# Altium project Charge Amplifier.PrjPcb
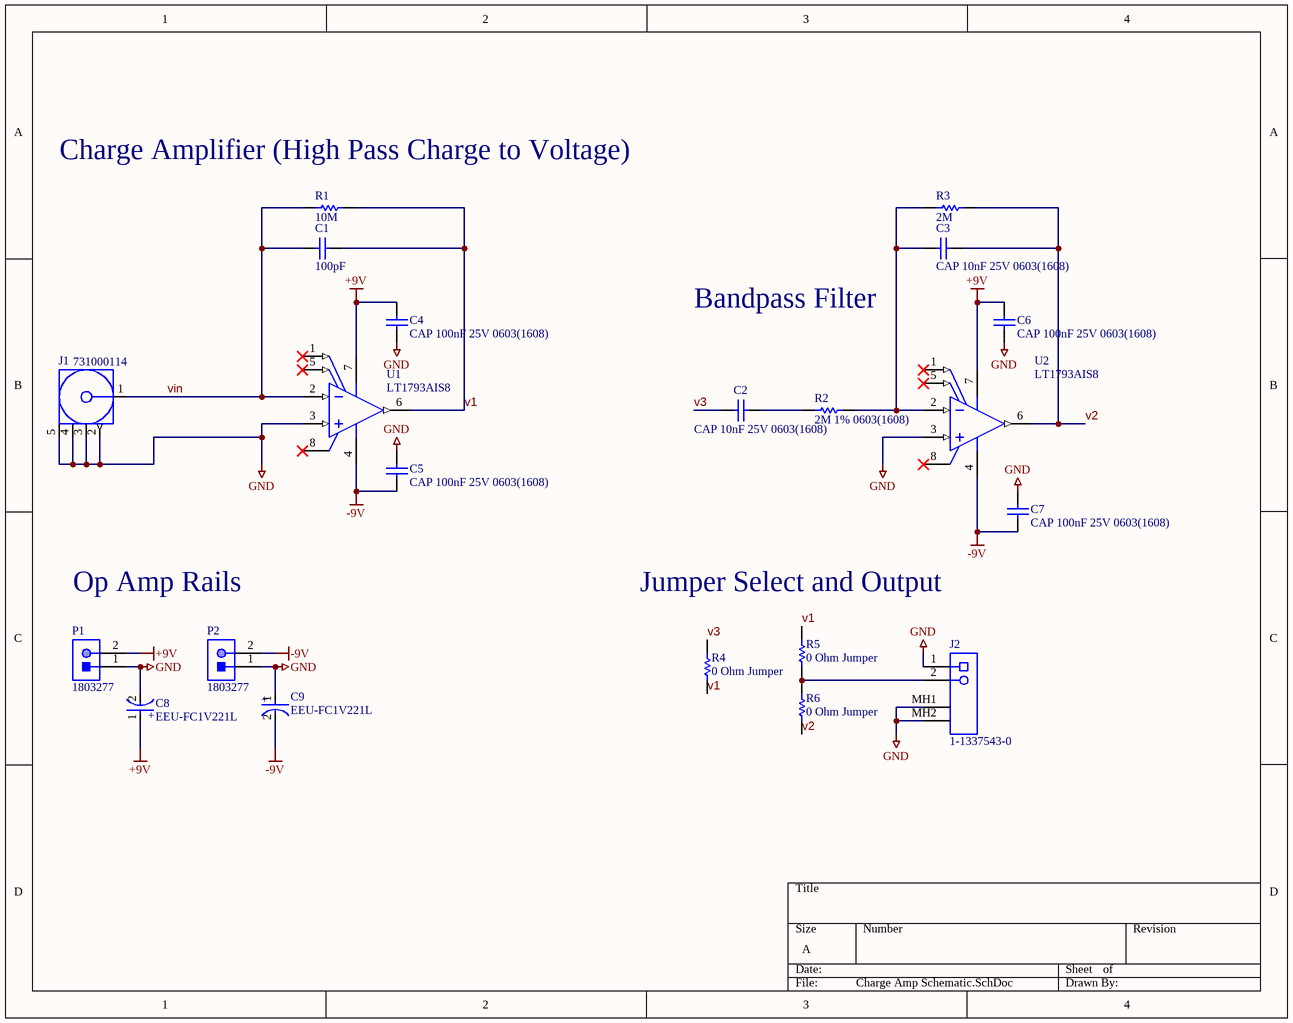
[diagram p0: Charge Amp Schematic.SchDoc]
1 sheet, 21 parts. Net scope: global (net labels, ports and power ports of the same name join across sheets).
Board file: Charge Amp PCB.PcbDoc

## Sheet Charge Amp Schematic.SchDoc
size A

### Parts
C1  100pF  [CAPC0603(1608)100_M]
C2  CAP 10nF 25V 0603(1608)  [CAPC0603(1608)100_M]
C3  CAP 10nF 25V 0603(1608)  [CAPC0603(1608)100_M]
C4  CAP 100nF 25V 0603(1608)  [CAPC0603(1608)100_N]
C5  CAP 100nF 25V 0603(1608)  [CAPC0603(1608)100_N]
C6  CAP 100nF 25V 0603(1608)  [CAPC0603(1608)100_N]
C7  CAP 100nF 25V 0603(1608)  [CAPC0603(1608)100_N]
C8  EEU-FC1V221L  [FP-EEU-FC1V221L-MFG]
C9  EEU-FC1V221L  [FP-EEU-FC1V221L-MFG]
J1  731000114  [MOLX-731000114_V]
J2  1-1337543-0  [TECO-1-1337543-0_V]
P1  1803277  [PHOE-1803277_V]
P2  1803277  [PHOE-1803277_V]
R1  10M  [RESC0603(1608)_M]
R2  2M 1% 0603(1608)  [RESC0603(1608)_M]
R3  2M  [RESC0603(1608)_M]
R4  0 Ohm Jumper  [RESC0603(1608)_L]
R5  0 Ohm Jumper  [RESC0603(1608)_L]
R6  0 Ohm Jumper  [RESC0603(1608)_L]
U1  LT1793AIS8  [LT-S8-8_M]
U2  LT1793AIS8  [LT-S8-8_M]

### Nets
+9V: C4.2 C6.1 C8.1(C) P1.2 U1.7(V+) U2.7(V+)
-9V: C5.1 C7.2 C9.2(A) P2.2 U1.4(V-) U2.4(V-)
GND: C4.1 C5.2 C6.2 C7.1 C8.2(A) C9.1(C) J1.2 J1.3 J1.4 J1.5 J2.1 J2.MH1 J2.MH2 P1.1 P2.1 U1.3(+IN_A) U2.3(+IN_A)
v1: C1.2 R1.2 R4.1 R5.2 U1.6(OUT)
v2: C3.1 R3.2 R6.1 U2.6(OUT)
v3: C2.1 R4.2
vin: C1.1 J1.1 R1.1 U1.2(-IN_A)
NetC2_2: C2.2 R2.1
NetC3_2: C3.2 R2.2 R3.1 U2.2(-IN_A)
NetJ2_2: J2.2 R5.1 R6.2

Not connected (* = marked no-connect by the designer): U1 1(VOS_ADJ)* 5(VOS_ADJ)* 8(NC)*; U2 1(VOS_ADJ)* 5(VOS_ADJ)* 8(NC)*

### Notes on the sheet
- (near R1) Charge Amplifier (High Pass Charge to Voltage)
- Bandpass Filter
- Op Amp Rails
- Jumper Select and Output
- (in symbol CMP-05427-000010-1) +

### Library data of the parts
C1 = CMP-1035-02316-1: Tolerance: Â±5%; Case-EIA: 0603; Rated Voltage: 25 V; Value: 10nF; Case-Metric: 1608; Technology: SMT; Max Thickness: 1 mm
C2 C3 = CMP-1035-02316-1: CAP 10nF 25V ±5% 0603 (1608 Metric) Thickness 1mm SMD; Tolerance: Â±5%; Case-EIA: 0603; Case-Metric: 1608; Rated Voltage: 25 V; Technology: SMT; Max Thickness: 1 mm; Value: 10nF
C4-C7 = CMP-1035-02587-1: CAP 100nF 25V ±5% 0603 (1608 Metric) Thickness 1mm SMD; Case-EIA: 0603; Tolerance: Â±5%; Case-Metric: 1608; Technology: SMT; Max Thickness: 1 mm; Rated Voltage: 25 V; Value: 100nF
C8 C9 = CMP-05427-000010-1: CAP ALUM 220UF 20% 35V RADIAL; Manufacturer: Panasonic Electronic Components; Material: Aluminum; Leakage Current: 77uA; Esr: 0.085Ω; Life: 2000Hours; Automotive Grade: Grade 2; Dissipation Factor: 12%; Ripple Current: 730mA; Octopart: https://octopart.com/eeu-fc1v221l-panasonic-39478519; ComponentLink2URL: https://industrial.panasonic.com/cdbs/www-data/pdf/RDF0000/ABA0000C1209.pdf; Package: 0; Height: 16.5mm; Category: Cap; Value: 220uF; ComponentLink2Description: Datasheet; Lead Free: Yes; Device Class L2: Capacitors; Temperature Range High: +105°C; Mouser Description: Capacitor; Aluminum Electrolytic; Fc Radial Elec Cap 220uF 35V; Temperature: -55°C to +105°C; Digikey Description: CAP ALUM 220UF 20% 35V RADIAL; Device Class L3: Aluminum Electrolytic Capacitors; Manufacturer Part Number: EEU-FC1V221L; Device Class L1: Passive Components; Automotive: Yes; RoHS: TRUE; Temperature Range Low: -55°C; Capacitance: 220uF; Voltage Rating: 35V; Tolerance: 20%
J1 = CMP-2000-05487-1: SMA Right-Angle PCB Jack Receptacle, Brass Body, Gold Plated, 50 Ohm, 5-Pin THD, RoHS, Tray; Manufacturer: Molex; Datasheet Version: 09/2016; Package Description: 5-Pin Through Hole Device, Body 14.8 x 6.35 mm, Pitch 2.54 mm; Datasheet URL: http://www.molex.com/webdocs/datasheets/pdf/en-us/0731000114_RF_COAX_CONNECTORS.pdf; Manufacturer URL: http://www.molex.com/; Package Reference: 731000114; Mounting Technology: ThroughHole; Package URL: http://www.molex.com/pdm_docs/sd/731000114_sd.pdf
J2 = CMP-2000-05853-1: Female Connector, Pitch 2.54 mm, 1 x 2 Position, Height 15.8 mm, Tail Length 3.8 mm, / -55 to 85 degC, RoHS, Bulk; Manufacturer: TE Connectivity; Connector Body Style: RightAngleJack; Frequency Max: 4GHz; Coaxial Termination: Solder; Connector Mounting: PCBMount; SVHC: ToBeAdvised; Connector Type: BNCCoaxial; Impedance: 50ohm; Coaxial Cable Types: -; Manufacturer URL: http://www.te.com/; Package Reference: 1-1337543-0; Product Range: -; Datasheet URL: http://www.te.com/commerce/DocumentDelivery/DDEController?Action=showdoc&DocId=Customer+Drawing%7F1337543%7FG%7Fpdf%7FEnglish%7FENG_CD_1337543_G.pdf%7F1-1337543-0; Contact Plating: GoldPlatedContacts; Mounting Technology: ThroughHole; Package Description: Female Connector, Pitch 2.54 mm, 1 x 2 Position, Height 15.8 mm, Tail Length 3.8 mm; Contact Material: Brass; Datasheet Version: Rev. G, 12/2012
P1 P2 = CMP-1765-00001-1: Male Header, Pitch 3.81 mm, 1 x 2 Position, Height 7.25 mm, Tail Length 3.4 mm, RoHS, Bulk; Tolerance: 5%; Resistance: 10 kohm; Case\Package: 1205; Voltage Rating: 50 V; Power Rating: 248 mW; Elements: 4; ComponentLink3URL: https://www.phoenixcontact.com/online/portal/us/pxc/product_detail_page/!ut/p/b1/3ZfJkqM4EIafpR6AQmA2H9n3fTNcCLbCgDGrDfjpp6pmYg4T012XDh-MLkihiC__TGUqBcdwBKEIwNDDAScAfILja3qvq3Sp-2t6-ZrHROIxHs9bKIGYNs4AmcNZXsMcRDJQOIRPAEvchpoUjx1UTZ38Zl8Xbz54zDr6CpsNzjayIR3; Case Code (Metric): 3216; Length: 0.126 inch; Case Code (Imperial): 1206; Mount: Surface Mount; Packaging: Cut Tape; PackageDescription: Male Header, Pitch 3.81 mm, 1 x 2 Position, Height 7.25 mm, Tail Length 3.4 mm; ComponentLink2Description: Datasheet; REACH SVHC: No SVHC; ComponentLink2URL: https://datasheet.ciiva.com/16096/1803277-16096845.pdf; Package Quantity: 1; Min Operating Temperature: -55 degC; ComponentLink1URL: http://www.phoenixcontact.com/; ComponentLink3Description: Package Specification; ComponentLink1Description: Manufacturer URL; Radiation Hardening: No; PackageReference: 1803277; RoHSCompliant: true; Max Operating Temperature: 125 degC; Width: 0.063 inch; Height: 0.024 inch; DatasheetVersion: Feb-14; Pins: 8
R1 = CMP-1012-00881-1: Tolerance: 1 %; Case-Metric: 1608; Power: 0.1 W; Case-EIA: 0603; Value: 2000000.00 Ohm; Technology: SMT
R2 R3 = CMP-1012-00881-1: 2M 0.1W 1% 0603 (1608 Metric)  SMD; Case-Metric: 1608; Case-EIA: 0603; Value: 2000000.00 Ohm; Tolerance: 1 %; Power: 0.1 W; Technology: SMT
R4 = CMP-1012-00284-1: Case-Metric: 1608; Tolerance: 1 %; Power: 0.1 W; Case-EIA: 0603; Value: 10.00 Ohm; Technology: SMT
R5 R6 = CMP-1012-00284-1: 10R 0.1W 1% 0603 (1608 Metric)  SMD; Case-Metric: 1608; Case-EIA: 0603; Value: 10.00 Ohm; Tolerance: 1 %; Power: 0.1 W; Technology: SMT
U1 U2 = CMP-0359-03672-2: Single Channel, Low Distortion, Low Noise, Precision Operational Amplifier, Picoampere Bias Current, 4.2 MHz Typical GBW, 3.4 V/us Typical SR, 10 to 40 V, 8-Pin SOIC (S8-8), Industrial; Linear Technology Part Number: LT1793; Manufacturer: Linear Technology; Vos (mV) Guaranteed: 0.8; Vs Max (V): 40; Vos (mV) Typical: 0.25; Channels (#): 1; Vs Min (V): 10; Is (mA) Typical: 4.2; SR (V/us) Typical: 3.4; PackageVersion: Rev G; ComponentLink1Description: Manufacturer URL; PackageReference: LT-S8-8; RevisionNote: URLs updated; ComponentLink2Description: Datasheet; Mounting Technology: Surface Mount; PackageDescription: 8-Pin Plastic Small Outline, Body 4.9 x 3.9 mm, Pitch 1.27 mm; ComponentLink3URL: http://cds.linear.com/docs/en/packaging/05081610_G_SO8.pdf; ComponentLink3Description: Package Specification; Type: JFET; GBW (MHz) Typical: 4.2; ComponentLink2URL: http://cds.linear.com/docs/en/datasheet/1793f.pdf; PartNumber: LT1793AIS8; ComponentLink1URL: http://www.linear.com/